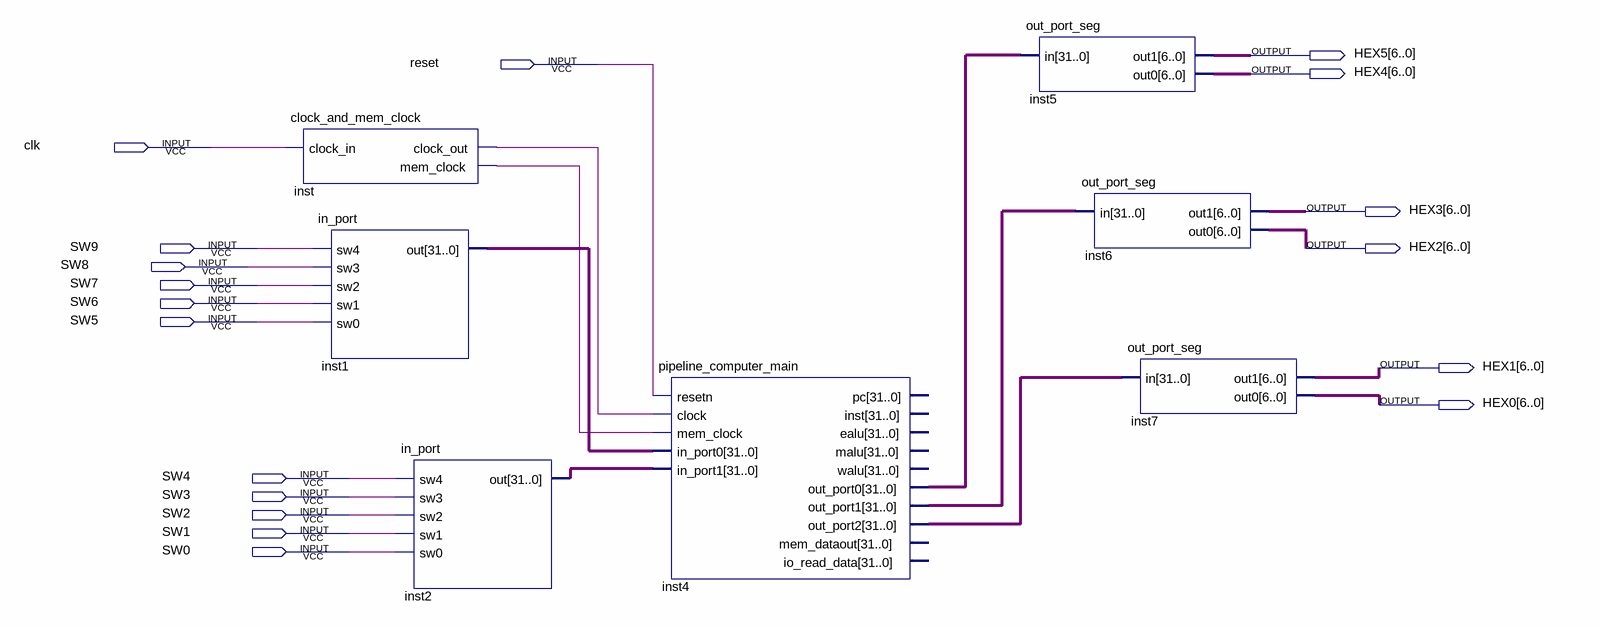
[diagram p0: schematic sheet]
// Quartus schematic test.bdf as structural Verilog: 7 symbols, 18 pins
module test (
  input  reset,
  input  clk,
  input  SW9,
  input  SW8,
  input  SW7,
  input  SW6,
  input  SW5,
  input  SW4,
  input  SW3,
  input  SW2,
  input  SW1,
  input  SW0,
  output [6:0] HEX5,
  output [6:0] HEX4,
  output [6:0] HEX3,
  output [6:0] HEX2,
  output [6:0] HEX1,
  output [6:0] HEX0
);

  wire inst_clock_out, inst_mem_clock;
  wire [31:0] inst1_out, inst2_out, inst4_out_port0, inst4_out_port1, inst4_out_port2;

  clock_and_mem_clock inst (.clock_in(clk), .clock_out(inst_clock_out), .mem_clock(inst_mem_clock));
  in_port inst1 (.sw4(SW9), .sw3(SW8), .sw2(SW7), .sw1(SW6), .sw0(SW5), .out(inst1_out));
  in_port inst2 (.sw4(SW4), .sw3(SW3), .sw2(SW2), .sw1(SW1), .sw0(SW0), .out(inst2_out));
  pipeline_computer_main inst4 (
    .resetn(reset), .clock(inst_clock_out), .mem_clock(inst_mem_clock), .in_port0(inst1_out),
    .in_port1(inst2_out), .out_port0(inst4_out_port0), .out_port1(inst4_out_port1),
    .out_port2(inst4_out_port2));  // open: pc, inst, ealu, malu, walu, mem_dataout, io_read_data
  out_port_seg inst5 (.in(inst4_out_port0), .out1(HEX5), .out0(HEX4));
  out_port_seg inst6 (.in(inst4_out_port1), .out1(HEX3), .out0(HEX2));
  out_port_seg inst7 (.in(inst4_out_port2), .out1(HEX1), .out0(HEX0));
endmodule
